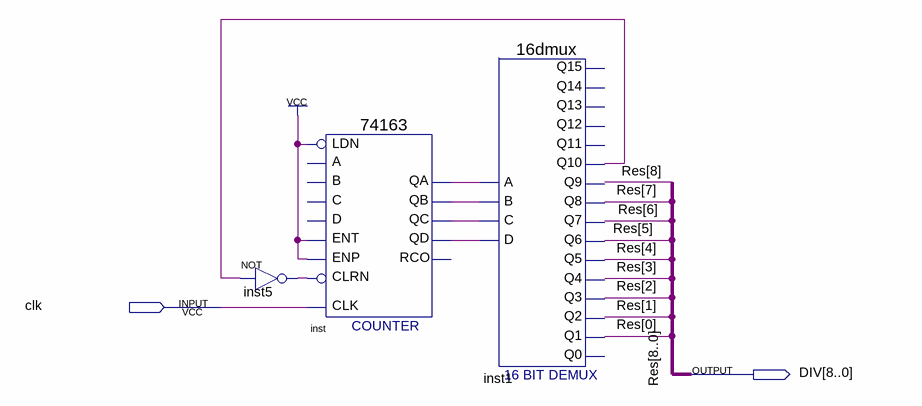
[diagram p0: schematic sheet]
// Quartus schematic Div_Block.bdf as structural Verilog: 3 symbols, 2 pins
module Div_Block (
  input  clk,
  output [8:0] DIV
);

  wire inst1_q10, inst5_out, inst_qa, inst_qb, inst_qc, inst_qd;

  not inst5 (inst5_out, inst1_q10);
  \74163  inst (
    .ENT(1'b1), .CLRN(inst5_out), .CLK(clk), .ENP(1'b1), .LDN(1'b1), .QA(inst_qa), .QB(inst_qb),
    .QC(inst_qc), .QD(inst_qd));  // open: C, B, A, D, RCO
  \16dmux  inst1 (
    .C(inst_qc), .B(inst_qb), .A(inst_qa), .D(inst_qd), .Q9(DIV[8]), .Q10(inst1_q10), .Q7(DIV[6]),
    .Q8(DIV[7]), .Q4(DIV[3]), .Q5(DIV[4]), .Q6(DIV[5]), .Q2(DIV[1]), .Q3(DIV[2]), .Q1(DIV[0]));  // open: Q12, Q13, Q11, Q14, Q15, Q0

  // Other names for the same wires on the sheet: Res[8:0] = DIV
endmodule
